# Altium project Simple Fan Controller.PrjPCB
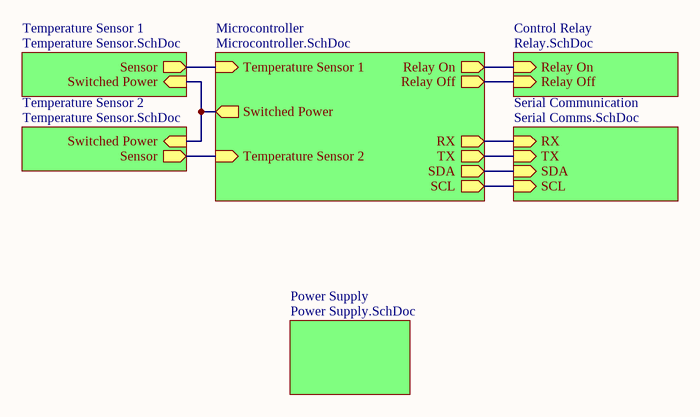
[diagram p0: Fan Controller Overview.SchDoc]
7 sheets, 33 parts. Net scope: hierarchical (ports join the sheet entries above them; power ports are global).
Sheets:
  Fan Controller Overview.SchDoc
    Microcontroller = Microcontroller.SchDoc
      Programming Jack = Programming Jack.SchDoc
    Control Relay = Relay.SchDoc
    Temperature Sensor 1 = Temperature Sensor.SchDoc
    Temperature Sensor 2 = Temperature Sensor.SchDoc
    Power Supply = Power Supply.SchDoc
    Serial Communication = Serial Comms.SchDoc

## Sheet Fan Controller Overview.SchDoc
size A4; DrawnBy: Craig Comberbach; DocumentNumber: 1; Revision: A1; SheetNumber: 1; SheetTotal: 7

### Sub-sheets
Control Relay = Relay.SchDoc: Relay On (in), Relay Off (in)
Microcontroller = Microcontroller.SchDoc: Temperature Sensor 1 (in), Temperature Sensor 2 (in), Relay On (out), Relay Off (out), Switched Power (out), RX (out), TX (out), SDA (out), SCL (out)
Power Supply = Power Supply.SchDoc: no entries
Serial Communication = Serial Comms.SchDoc: RX (in), TX (in), SDA (in), SCL (in)
Temperature Sensor 1 = Temperature Sensor.SchDoc: Sensor (out), Switched Power (in)
Temperature Sensor 2 = Temperature Sensor.SchDoc: Sensor (out), Switched Power (in)

### Nets
NetR5_1: sheet Microcontroller/Relay On, sheet Control Relay/Relay On
NetR6_2: sheet Microcontroller/Relay Off, sheet Control Relay/Relay Off
NetR9_2: sheet Microcontroller/SCL, sheet Serial Communication/SCL
NetR10_2: sheet Microcontroller/SDA, sheet Serial Communication/SDA
NetR11_2: sheet Microcontroller/TX, sheet Serial Communication/TX
NetR12_2: sheet Microcontroller/RX, sheet Serial Communication/RX
NetR13A_2: sheet Microcontroller/Switched Power, sheet Temperature Sensor 1/Switched Power, sheet Temperature Sensor 2/Switched Power
NetR14A_2: sheet Microcontroller/Temperature Sensor 1, sheet Temperature Sensor 1/Sensor
NetR14B_2: sheet Microcontroller/Temperature Sensor 2, sheet Temperature Sensor 2/Sensor

## Sheet Microcontroller.SchDoc
size A4; DrawnBy: Craig Comberbach; DocumentNumber: 2; Revision: A1; SheetNumber: 2; SheetTotal: 7
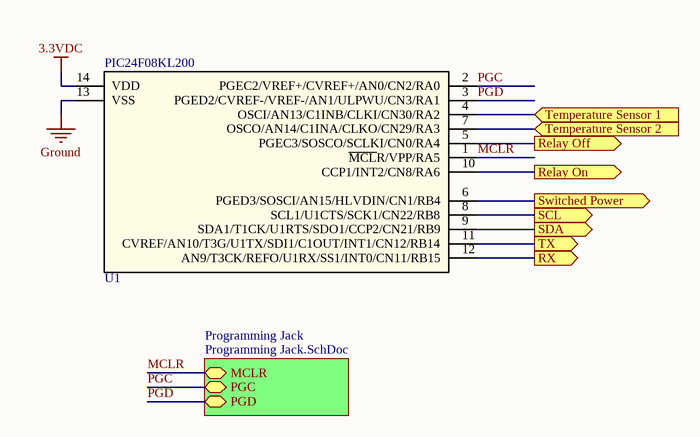
[diagram p1: Microcontroller.SchDoc]

### Parts
U1  PIC24F08KL200

### Sub-sheets
Programming Jack = Programming Jack.SchDoc: MCLR (bidir), PGC (bidir), PGD (bidir)

### Ports
Relay Off (out), Relay On (out), RX (out), SCL (out), SDA (out), Switched Power (out), Temperature Sensor 1 (in), Temperature Sensor 2 (in), TX (out)

### Nets
3.3VDC: U1.14(VDD)
Ground: U1.13(VSS)
MCLR: U1.1(~{MCL}R/VPP/RA5) ; sheet Programming Jack/MCLR
PGC: U1.2(PGEC2/VREF+/CVREF+/AN0/CN2/RA0) ; sheet Programming Jack/PGC
PGD: U1.3(PGED2/CVREF-/VREF-/AN1/ULPWU/CN3/RA1) ; sheet Programming Jack/PGD
NetR5_1: U1.10(CCP1/INT2/CN8/RA6) ; port Relay On
NetR6_2: U1.5(PGEC3/SOSCO/SCLKI/CN0/RA4) ; port Relay Off
NetR9_2: U1.8(SCL1/U1CTS/SCK1/CN22/RB8) ; port SCL
NetR10_2: U1.9(SDA1/T1CK/U1RTS/SDO1/CCP2/CN21/RB9) ; port SDA
NetR11_2: U1.11(CVREF/AN10/T3G/U1TX/SDI1/C1OUT/INT1/CN12/RB14) ; port TX
NetR12_2: U1.12(AN9/T3CK/REFO/U1RX/SS1/INT0/CN11/RB15) ; port RX
NetR13A_2: U1.6(PGED3/SOSCI/AN15/HLVDIN/CN1/RB4) ; port Switched Power
NetR14A_2: U1.4(OSCI/AN13/C1INB/CLKI/CN30/RA2) ; port Temperature Sensor 1
NetR14B_2: U1.7(OSCO/AN14/C1INA/CLKO/CN29/RA3) ; port Temperature Sensor 2

### Library data of the parts
U1 = PIC24F08KL200: QuickValue: PIC24F08KL200; Value: PIC24F08KL200; Technology: THT; Supplier 1: Digi-Key; Supplier Part Number 1: PIC24F08KL200-I/P-ND; Package: DIP-14

## Sheet Programming Jack.SchDoc
size A4; DrawnBy: Craig Comberbach; DocumentNumber: 3; Revision: A1; SheetNumber: 3; SheetTotal: 7
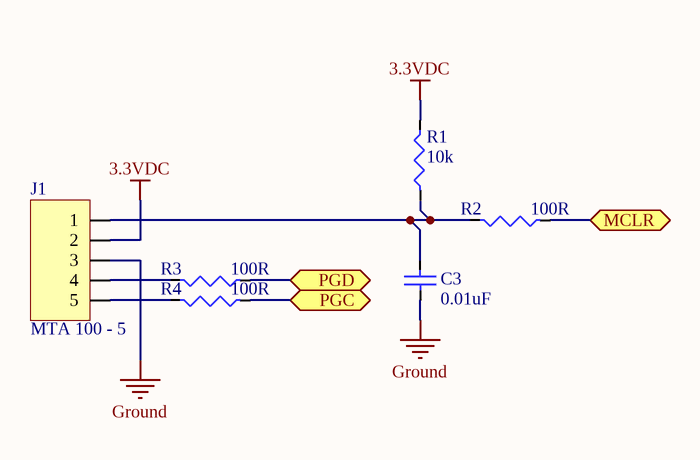
[diagram p2: Programming Jack.SchDoc]

### Parts
C3  QuickValue: 0.01uF  [Capacitor - 0603]  (hidden comment: Capacitor (Non-polarized))
J1  QuickValue: MTA 100 - 5  [MTA-100-5P]  (hidden comment: Flash connector, 5 Position)
R1  QuickValue: 10k  [RESISTOR THT 3W 0.05HOLE 900MIL]  (hidden comment: Resistor)
R2  QuickValue: 100R  [Resistor - 0603]  (hidden comment: Resistor)
R3  QuickValue: 100R  [Resistor - 0603]  (hidden comment: Resistor)
R4  QuickValue: 100R  [Resistor - 0603]  (hidden comment: Resistor)

### Ports
MCLR (bidir), PGC (bidir), PGD (bidir)

### Nets
3.3VDC: J1.2 R1.2
Ground: C3.2 J1.3
MCLR: R2.1 ; port MCLR
PGC: R4.1 ; port PGC
PGD: R3.1 ; port PGD
NetC3_1: C3.1 J1.1 R1.1 R2.2
NetJ1_4: J1.4 R3.2
NetJ1_5: J1.5 R4.2

### Library data of the parts
C3 = Capacitor (Non-polarized): Non-polarized; Value: 0.01uF 0603 10% 50V; Tolerance: 10%; Voltage: 50V; Technology: THT; Supplier 1: Digi-Key; Supplier Part Number 1: 399-4206-ND; Package: Radial
J1 = Flash connector, 5 Position: Flash header; Value: MTA 100 - 5 Position Connector, Verticle, Friction Lock; Technology: THT; Package: MTA-100; Supplier 1: Digi-Key; Supplier Part Number 1: A19471-ND
R1 = Resistor: Value: 10k 1/4W 1%; Tolerance: 1%; Technology: THT; Supplier 1: Digi-Key; Supplier Part Number 1: 10.0KXBK-ND; Package: 1/4W
R2-R4 = Resistor: Value: 100R 1/4W 1%; Tolerance: 1%; Technology: THT; Supplier 1: Digi-Key; Supplier Part Number 1: 100XBK-ND; Package: 1/4W

## Sheet Relay.SchDoc
size A4; DrawnBy: Craig Comberbach; DocumentNumber: 4; Revision: A1; SheetNumber: 4; SheetTotal: 7
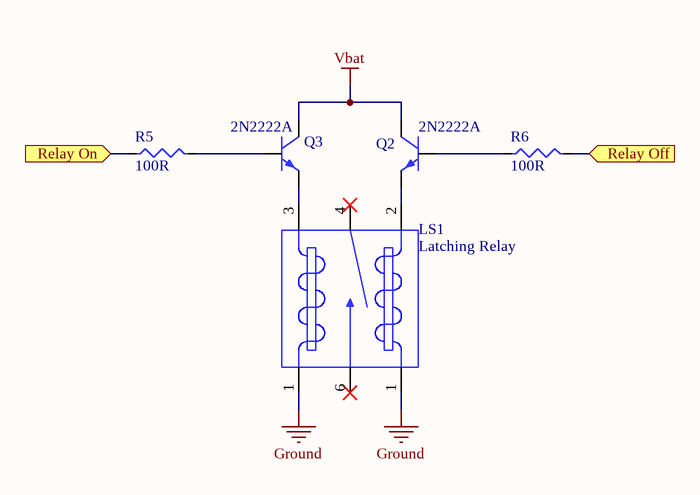
[diagram p3: Relay.SchDoc]

### Parts
LS1  QuickValue: Latching Relay  (hidden comment: Relay SPST, Latching)
Q2  QuickValue: 2N2222A  (hidden comment: Transistor - NPN BJT)
Q3  QuickValue: 2N2222A  (hidden comment: Transistor - NPN BJT)
R5  QuickValue: 100R  [RESISTOR THT 5W 0.05HOLE 900MIL]  (hidden comment: Resistor)
R6  QuickValue: 100R  [RESISTOR THT 5W 0.05HOLE 900MIL]  (hidden comment: Resistor)

### Ports
Relay Off (in), Relay On (in)

### Nets
4: LS1.5
6: LS1.7
Ground: LS1.1
Vbat: Q2.2(Collector) Q3.2(Collector)
NetLS1_2: LS1.2 Q2.3(Emitter)
NetLS1_3: LS1.3 Q3.3(Emitter)
NetQ2_1: Q2.1(Base) R6.1
NetQ3_1: Q3.1(Base) R5.2
NetR5_1: R5.1 ; port Relay On
NetR6_2: R6.2 ; port Relay Off

Not connected (* = marked no-connect by the designer): LS1 4* 6*

### Library data of the parts
Q2 Q3 = Transistor - NPN BJT: NPN BJT Transistor; Value: 2N2222A; Technology: THT; Supplier 1: Digi-Key; Supplier Part Number 1: P2N2222AGOS-ND; Package: TO92-3
R5 R6 = Resistor: Value: 100R 1/4W 1%; Tolerance: 1%; Technology: THT; Supplier 1: Digi-Key; Supplier Part Number 1: 100XBK-ND; Package: 1/4W
LS1 = Relay SPST, Latching: Value: Relay; Supplier 1: Digi-Key; Supplier Part Number 1: 255-1442-ND; Technology: THT; Package: Relay

## Sheet Temperature Sensor.SchDoc
size A4; DrawnBy: Craig Comberbach; DocumentNumber: 5; Revision: A1; SheetNumber: 5; SheetTotal: 7
Used 2 times, as channels Temperature Sensor 1, Temperature Sensor 2. Parts and nets are listed once, with the designators drawn on the sheet.
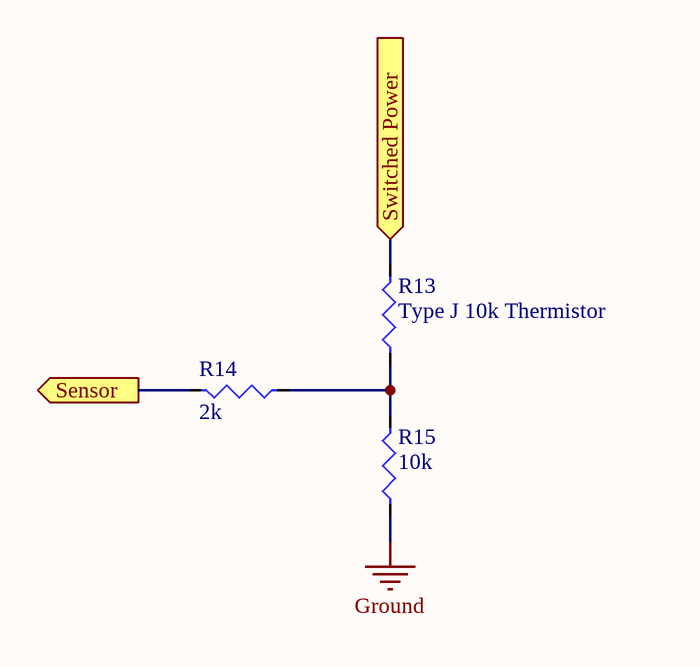
[diagram p4: Temperature Sensor.SchDoc]

### Parts
R13  QuickValue: Type J 10k Thermistor  [RESISTOR THT 3W 0.05HOLE 900MIL]  (hidden comment: Resistor)
R14  QuickValue: 2k  [RESISTOR THT 3W 0.05HOLE 900MIL]  (hidden comment: Resistor)
R15  QuickValue: 10k  [RESISTOR THT 3W 0.05HOLE 900MIL]  (hidden comment: Resistor)

### Ports
Sensor (out), Switched Power (in)

### Nets
Ground: R15.1
Sensor: R14.2 ; port Sensor
Switched Power: R13.2 ; port Switched Power
NetR13_1: R13.1 R14.1 R15.2

### Channels
Temperature Sensor 1: designators end in A; ports Sensor=NetR14A_2 Switched Power=NetR13A_2
Temperature Sensor 2: designators end in B; ports Sensor=NetR14B_2 Switched Power=NetR13A_2

### Library data of the parts
R13 = Resistor: Value: Type J 10k Thermistor 1/4W 1%; Tolerance: 1%; Technology: THT; Supplier 1: Digi-Key; Supplier Part Number 1: 615-1016-ND; Package: 1/4W
R14 = Resistor: Value: 2k 1/4W 1%; Tolerance: 1%; Technology: THT; Supplier 1: Digi-Key; Supplier Part Number 1: 2.00KXBK-ND; Package: 1/4W
R15 = Resistor: Value: 10k 1/4W 1%; Tolerance: 1%; Technology: THT; Supplier 1: Digi-Key; Supplier Part Number 1: 10.0KXBK-ND; Package: 1/4W

## Sheet Power Supply.SchDoc
size A4; DrawnBy: Craig Comberbach; DocumentNumber: 6; Revision: A1; SheetNumber: 6; SheetTotal: 7
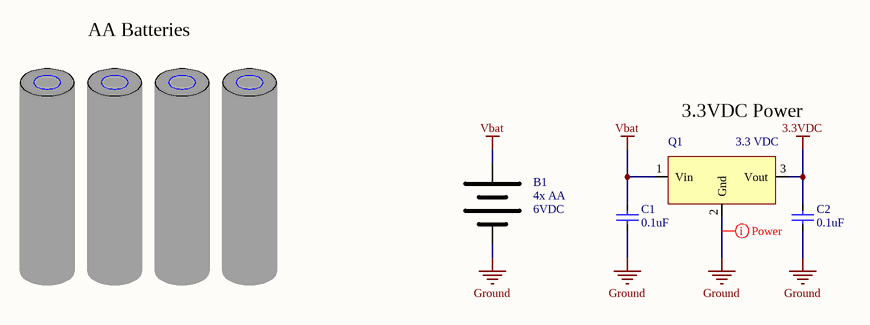
[diagram p5: Power Supply.SchDoc]

### Parts
B1  QuickValue: 4x AA  Voltage: 6VDC  (hidden comment: Battery)
B2  AA Battery  (value not drawn)
B3  AA Battery  (value not drawn)
B4  AA Battery  (value not drawn)
B5  AA Battery  (value not drawn)
C1  QuickValue: 0.1uF  [Capacitor - 0603]
C2  QuickValue: 0.1uF  [Capacitor - 0603]
Q1  QuickValue: 3.3 VDC  [SOT223-B - v2]  (hidden comment: Voltage Regulator, Fixed)

### Nets
3.3VDC: C2.1 Q1.3(Vout)
Ground: B1.2(Negative) C1.2 C2.2 Q1.2(Gnd)
Vbat: B1.1(Positive) C1.1 Q1.1(Vin)

### Layout directives
net class Power: Ground

### Notes on the sheet
- AA Batteries
- 3.3VDC Power

### Library data of the parts
B1 = Battery: Value: 4x AA Battery holder; Technology: THT; Supplier 1: Digi-Key; Supplier Part Number 1: SBH341AS-ND; Package: 4xAA
B2-B5 = AA Battery: Battery; Voltage: 1.5VDC; Value: AA Battery; QuickValue: AA Battery; Technology: THT; Supplier 1: Digi-Key; Supplier Part Number 1: P646-ND; Package: AA
C1 C2 = Capacitor (Non-polarized): Non-polarized; Value: 0.1uF 0603 10% 50V X7R; Notes: X7R; Tolerance: 10%; Voltage: 50V; Technology: THT; Supplier 1: Digi-Key; Supplier Part Number 1: 399-4491-1-ND; Package: Radial
Q1 = Voltage Regulator, Fixed: Value: 3.3 VDC fixed regulator; Technology: THT; Supplier 1: Digi-Key; Supplier Part Number 1: 497-7288-ND; Package: TO92-3

## Sheet Serial Comms.SchDoc
size A4; DrawnBy: Craig Comberbach; DocumentNumber: 7; Revision: A1; SheetNumber: 7; SheetTotal: 7
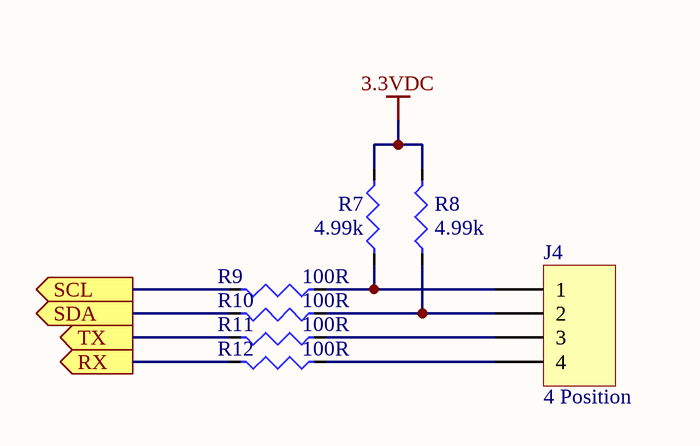
[diagram p6: Serial Comms.SchDoc]

### Parts
J4  QuickValue: 4 Position  [4POS TBLOCK_REV2]  (hidden comment: MTA 100 - 4 Position)
R7  QuickValue: 4.99k  [RESISTOR THT 3W 0.05HOLE 900MIL]  (hidden comment: Resistor)
R8  QuickValue: 4.99k  [RESISTOR THT 3W 0.05HOLE 900MIL]  (hidden comment: Resistor)
R9  QuickValue: 100R  [Resistor - 0603]  (hidden comment: Resistor)
R10  QuickValue: 100R  [Resistor - 0603]  (hidden comment: Resistor)
R11  QuickValue: 100R  [Resistor - 0603]  (hidden comment: Resistor)
R12  QuickValue: 100R  [Resistor - 0603]  (hidden comment: Resistor)

### Ports
RX (out), SCL (out), SDA (out), TX (out)

### Nets
3.3VDC: R7.2 R8.2
NetJ4_1: J4.1 R7.1 R9.1
NetJ4_2: J4.2 R8.1 R10.1
NetJ4_3: J4.3 R11.1
NetJ4_4: J4.4 R12.1
NetR9_2: R9.2 ; port SCL
NetR10_2: R10.2 ; port SDA
NetR11_2: R11.2 ; port TX
NetR12_2: R12.2 ; port RX

### Library data of the parts
J4 = Header 4: Header, 4-Pin; Technology: THT; Value: MTA 100 - 4 Position; Package: MTA-100; Supplier 1: Digi-Key; Supplier Part Number 1: A1922-ND
R7 R8 = Resistor: Value: 4.99k 1/4W 1%; Tolerance: 1%; Technology: THT; Supplier 1: Digi-Key; Supplier Part Number 1: 4.99KXBK-ND; Package: 1/4W
R9-R12 = Resistor: Value: 100R 1/4W 1%; Tolerance: 1%; Technology: THT; Supplier 1: Digi-Key; Supplier Part Number 1: 100XBK-ND; Package: 1/4W

## Nets that join several sheets
3.3VDC: Microcontroller (U1.14), Programming Jack (J1.2 R1.2), Power Supply (C2.1 Q1.3), Serial Comms (R7.2 R8.2)
Ground: Microcontroller (U1.13), Programming Jack (C3.2 J1.3), Relay (LS1.1), Temperature Sensor 1 (R15A.1), Temperature Sensor 2 (R15B.1), Power Supply (B1.2 C1.2 C2.2 Q1.2)
Vbat: Relay (Q2.2 Q3.2), Power Supply (B1.1 C1.1 Q1.1)
MCLR: Microcontroller (U1.1), Programming Jack (R2.1)
NetR5_1: Microcontroller (U1.10), Relay (R5.1)
NetR6_2: Microcontroller (U1.5), Relay (R6.2)
NetR9_2: Microcontroller (U1.8), Serial Comms (R9.2)
NetR10_2: Microcontroller (U1.9), Serial Comms (R10.2)
NetR11_2: Microcontroller (U1.11), Serial Comms (R11.2)
NetR12_2: Microcontroller (U1.12), Serial Comms (R12.2)
NetR13A_2: Microcontroller (U1.6), Temperature Sensor 1 (R13A.2), Temperature Sensor 2 (R13B.2)
NetR14A_2: Microcontroller (U1.4), Temperature Sensor 1 (R14A.2)
NetR14B_2: Microcontroller (U1.7), Temperature Sensor 2 (R14B.2)
PGC: Microcontroller (U1.2), Programming Jack (R4.1)
PGD: Microcontroller (U1.3), Programming Jack (R3.1)